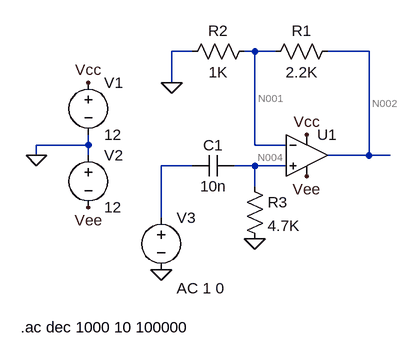
[diagram p0: schematic Draft1.asc]
Draft1.asc, the LTspice schematic file:
Version 4
SHEET 1 880 680
WIRE 144 0 112 0
WIRE 240 0 224 0
WIRE 272 0 240 0
WIRE 416 0 352 0
WIRE 112 48 112 0
WIRE -16 144 -16 128
WIRE -16 144 -96 144
WIRE 240 144 240 0
WIRE 288 144 240 144
WIRE -96 160 -96 144
WIRE -16 160 -16 144
WIRE 416 160 416 0
WIRE 416 160 352 160
WIRE 448 160 416 160
WIRE 144 176 96 176
WIRE 240 176 208 176
WIRE 288 176 240 176
WIRE 240 208 240 176
WIRE 96 256 96 176
FLAG -96 160 0
FLAG 112 48 0
FLAG -16 48 Vcc
FLAG -16 240 Vee
FLAG 320 128 Vcc
FLAG 320 192 Vee
FLAG 96 336 0
FLAG 240 288 0
SYMBOL voltage -16 32 R0
SYMATTR InstName V1
SYMATTR Value 12
SYMBOL voltage -16 144 R0
SYMATTR InstName V2
SYMATTR Value 12
SYMBOL res 240 -16 R90
WINDOW 0 0 56 VBottom 2
WINDOW 3 32 56 VTop 2
SYMATTR InstName R2
SYMATTR Value 1K
SYMBOL res 368 -16 R90
WINDOW 0 0 56 VBottom 2
WINDOW 3 32 56 VTop 2
SYMATTR InstName R1
SYMATTR Value 2.2K
SYMBOL Opamps\\UniversalOpamp2 320 160 R0
SYMATTR InstName U1
SYMBOL res 224 192 R0
SYMATTR InstName R3
SYMATTR Value 4.7K
SYMBOL cap 208 160 R90
WINDOW 0 0 32 VBottom 2
WINDOW 3 32 32 VTop 2
SYMATTR InstName C1
SYMATTR Value 10n
SYMBOL voltage 96 240 R0
WINDOW 123 24 124 Left 2
WINDOW 39 0 0 Left 2
SYMATTR InstName V3
SYMATTR Value ""
SYMATTR Value2 AC 1 0
TEXT -120 424 Left 2 !.ac dec 1000 10 100000

The netlist it stands for:
* Draft1.asc
V1 Vcc 0 12
V2 0 Vee 12
R2 N001 0 1K
R1 N002 N001 2.2K
XU1 N004 N001 Vcc Vee N002 level.2 Avol=1Meg GBW=10Meg Slew=10Meg ilimit=25m rail=0 Vos=0 phimargin=45 en=0 enk=0 in=0 ink=0 Rin=500Meg  ; pins IN+ IN- V+ V- OUT
R3 N004 0 4.7K
C1 N004 N003 10n
V3 N003 0 AC 1 0
.ac dec 1000 10 100000
.lib UniversalOpamps2.sub
.backanno
.end

* Results of the author's LTspice run, read from the files saved beside the schematic
* Operating Point, zero values left out:
*   V(vcc) = 12 V
*   V(vee) = -12 V
*   I(V2) = -1.199 mA
*   I(V1) = -1.199 mA
*   Ix(u1:3) = 1.199 mA
*   Ix(u1:4) = -1.199 mA
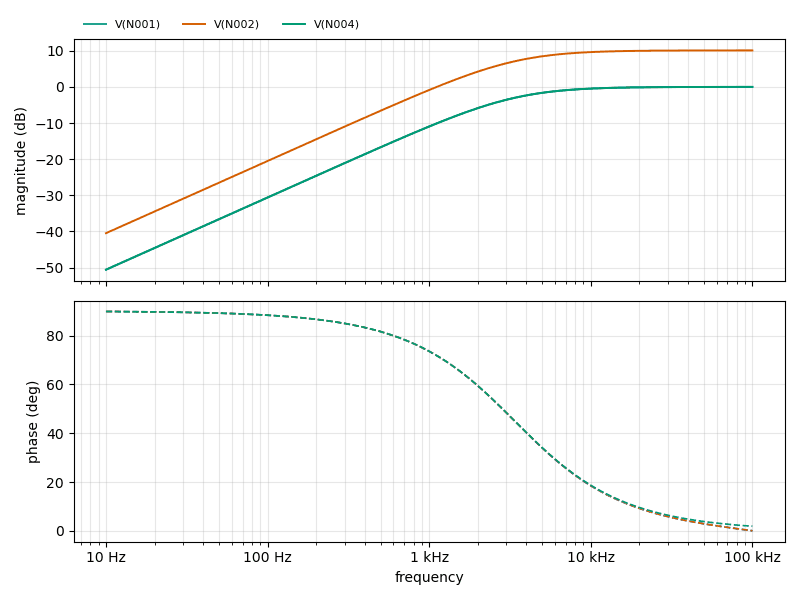
[diagram p1: AC Analysis of Draft1.asc, plotted from the saved traces]
* AC Analysis, 1 run:
*   V(N001): -50.59 dB at 10 Hz, -0.01 dB at 100 kHz, peak -0.01 dB at 100 kHz, 3 dB below the peak at 3.379 kHz
*   V(N002): -40.49 dB at 10 Hz, 10.09 dB at 100 kHz, peak 10.09 dB at 100 kHz, 3 dB below the peak at 3.379 kHz
*   V(N004): -50.59 dB at 10 Hz, -0.00 dB at 100 kHz, peak -0.00 dB at 100 kHz, 3 dB below the peak at 3.382 kHz